# Altium project Calculator.PrjPcb
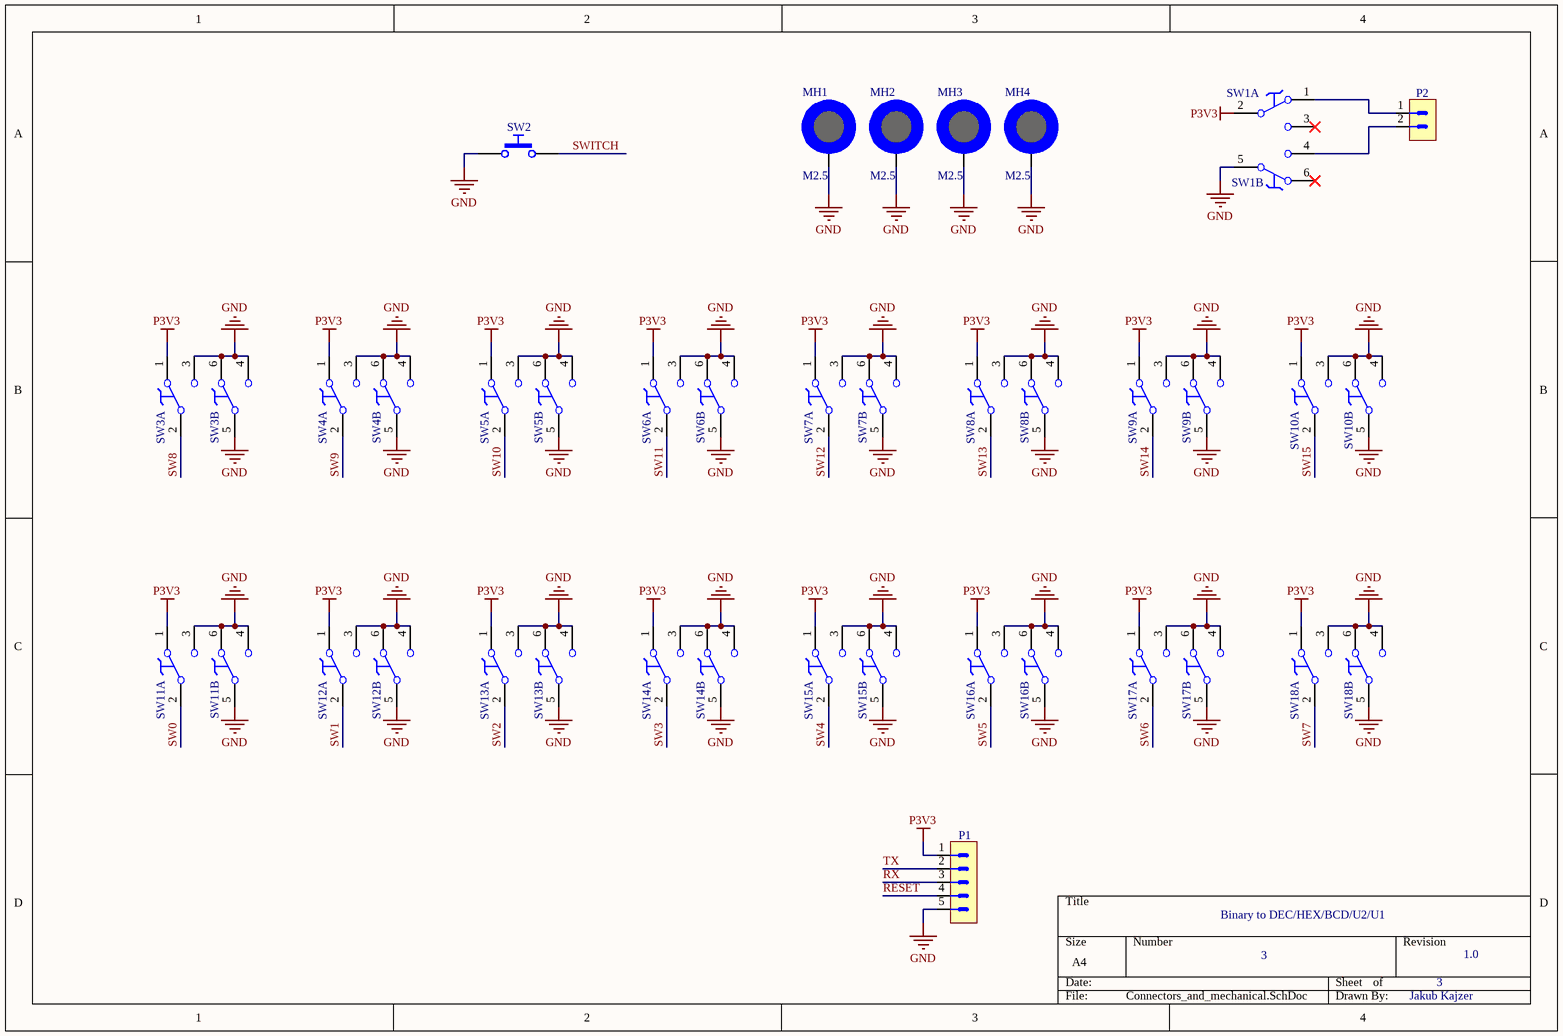
[diagram p0: Connectors_and_mechanical.SchDoc]
4 sheets, 67 parts. Net scope: global (net labels, ports and power ports of the same name join across sheets).
Board file: Calculator.PcbDoc
Sheets:
  Connectors_and_mechanical.SchDoc
  LEDs.SchDoc
  uC.SchDoc
  DCDC_Converter.SchDoc

## Sheet Connectors_and_mechanical.SchDoc: Binary to DEC/HEX/BCD/U2/U1
size A4; Author: Jakub Kajzer; DrawnBy: Jakub Kajzer; DocumentNumber: 3; Revision: 1.0; SheetNumber: 3; SheetTotal: 3

### Parts
MH1  M2.5  [MH-M2.5_COPPER]  (no BOM)
MH2  M2.5  [MH-M2.5_COPPER]  (no BOM)
MH3  M2.5  [MH-M2.5_COPPER]  (no BOM)
MH4  M2.5  [MH-M2.5_COPPER]  (no BOM)
P1  SSW-105-02-G-S  [SAMTEC_SSW-105-02-G-S]  (value not drawn)
P2  MTLW-102-07-G-S-250  [SAMTEC_MTLW-102-07-G-S-250]  (value not drawn)
SW1  SS008B  [SS008B-02P-22]  (value not drawn)  (parts A,B of 2)
SW2  PTS636  [PTS636_SMT_G]  (value not drawn)
SW3  SS008B  [SS008B-02P-22]  (value not drawn)  (parts A,B of 2)
SW4  SS008B  [SS008B-02P-22]  (value not drawn)  (parts A,B of 2)
SW5  SS008B  [SS008B-02P-22]  (value not drawn)  (parts A,B of 2)
SW6  SS008B  [SS008B-02P-22]  (value not drawn)  (parts A,B of 2)
SW7  SS008B  [SS008B-02P-22]  (value not drawn)  (parts A,B of 2)
SW8  SS008B  [SS008B-02P-22]  (value not drawn)  (parts A,B of 2)
SW9  SS008B  [SS008B-02P-22]  (value not drawn)  (parts A,B of 2)
SW10  SS008B  [SS008B-02P-22]  (value not drawn)  (parts A,B of 2)
SW11  SS008B  [SS008B-02P-22]  (value not drawn)  (parts A,B of 2)
SW12  SS008B  [SS008B-02P-22]  (value not drawn)  (parts A,B of 2)
SW13  SS008B  [SS008B-02P-22]  (value not drawn)  (parts A,B of 2)
SW14  SS008B  [SS008B-02P-22]  (value not drawn)  (parts A,B of 2)
SW15  SS008B  [SS008B-02P-22]  (value not drawn)  (parts A,B of 2)
SW16  SS008B  [SS008B-02P-22]  (value not drawn)  (parts A,B of 2)
SW17  SS008B  [SS008B-02P-22]  (value not drawn)  (parts A,B of 2)
SW18  SS008B  [SS008B-02P-22]  (value not drawn)  (parts A,B of 2)

### Nets
GND: MH1.MH MH2.MH MH3.MH MH4.MH P1.5 SW1.5 SW2.1 SW3.3 SW3.4 SW3.5 SW3.6 SW4.3 SW4.4 SW4.5 SW4.6 SW5.3 SW5.4 SW5.5 SW5.6 SW6.3 SW6.4 SW6.5 SW6.6 SW7.3 SW7.4 SW7.5 SW7.6 SW8.3 SW8.4 SW8.5 SW8.6 SW9.3 SW9.4 SW9.5 SW9.6 SW10.3 SW10.4 SW10.5 SW10.6 SW11.3 SW11.4 SW11.5 SW11.6 SW12.3 SW12.4 SW12.5 SW12.6 SW13.3 SW13.4 SW13.5 SW13.6 SW14.3 SW14.4 SW14.5 SW14.6 SW15.3 SW15.4 SW15.5 SW15.6 SW16.3 SW16.4 SW16.5 SW16.6 SW17.3 SW17.4 SW17.5 SW17.6 SW18.3 SW18.4 SW18.5 SW18.6
P3V3: P1.1 SW1.2 SW3.1 SW4.1 SW5.1 SW6.1 SW7.1 SW8.1 SW9.1 SW10.1 SW11.1 SW12.1 SW13.1 SW14.1 SW15.1 SW16.1 SW17.1 SW18.1
RESET: P1.4
RX: P1.3
SW0: SW11.2
SW1: SW12.2
SW2: SW13.2
SW3: SW14.2
SW4: SW15.2
SW5: SW16.2
SW6: SW17.2
SW7: SW18.2
SW8: SW3.2
SW9: SW4.2
SW10: SW5.2
SW11: SW6.2
SW12: SW7.2
SW13: SW8.2
SW14: SW9.2
SW15: SW10.2
SWITCH: SW2.2
TX: P1.2
NetP2_1: P2.1 SW1.1
NetP2_2: P2.2 SW1.4

Not connected (* = marked no-connect by the designer): SW1 3* 6*

### Library data of the parts
MH1-MH4 = MH-M2.5_C: Mounting hole, M2.5, exposed pad; DesignItemId: MH-M2.5_C; Author: KB; Family: M2.5; Part Description: Mounting hole, M2.5, exposed pad; Create Date: 19.05.2011; LatestRevisionDate: 19.05.2011
P1 = HDR_THT_5X1V_F_2P54MM: General Purpose Header: THT, 2.54mm, Female, Straight, Long Lead; Manufacturer: GENERIC; Manufacturer 1 Example: Samtec; Manufacturer 1 Component Height: 11.55mm; Current Max: 3A; PressFit: No; Alt_Comment: SSW; DesignItemId: HDR_THT_5X1V_F_2P54MM; Author: UN; Family: SSW; Component Kind: Standard; Footprint: HDR_5X1V_F_2P54MM; HelpURL: https://pl.mouser.com/datasheet/2/527/ssw_th-1507658.pdf; Manufacturer Part Number: HDR_THT_5X1V_F_2P54MM; Manufacturer 1 Part Number: SSW-105-02-G-S; Mounted: Yes; Part Description: General Purpose Header: THT, 2.54mm, Female, Straight, Long Lead; Pin Count: 5; Sense: No; SMD: No; Socket: No; Status: Recommended; Supplier 1: TME; Supplier 2: Mouser; Create Date: 19.08.2014; LatestRevisionDate: 19.08.2014; Supplier Part Number 1: ZL262-5SG
P2 = HDR_THT_2X1V_M_2P54MM: General Purpose Header: THT, 2.54mm, Male, Straight; Manufacturer: GENERIC; Manufacturer 1 Example: Samtec; Manufacturer 1 Component Height: 10.92mm; Current Max: 5.2A; PressFit: No; Alt_Comment: MLTW; DesignItemId: HDR_THT_2X1V_M_2P54MM; Author: PC; Family: MLTW; Component Kind: Standard; Footprint: HDR_2X1V_M_2P54MM; HelpURL: https://pl.mouser.com/datasheet/2/527/mtlw_th-1370324.pdf; Manufacturer Part Number: HDR_THT_2X1V_M_2P54MM; Manufacturer 1 Part Number: MTLW-102-07-G-S-250; Mounted: Yes; Part Description: General Purpose Header: THT, 2.54mm, Male, Straight; Pin Count: 2; Sense: No; SMD: No; Socket: No; Status: Recommended; Supplier 1: Mouser; Supplier 2: Digi-Key; Supplier 3: Sager Electronics / Sager Electronics; Create Date: 19.08.2013; LatestRevisionDate: 19.08.2013; Supplier Part Number 1: 200-MTLW10207GS250
SW1 SW3-SW18 = SS008B-02P-22: Switch  2 position; DPDT; 0,3A/30VDC; ON-ON; 50mŁ[; Manufacturer: CANAL ELECTRONIC; Manufacturer 1 Component Height: 4.7mm; PressFit: No; DesignItemId: SS008B-02P-22; Author: JK; Family: SS008B; Component Kind: Standard; HelpURL: https://www.tme.eu/Document/b70a8664e2e58da8ce3209f25de299f1/ss008b02p22.pdf; Manufacturer Part Number: SS008B-02P-22; Manufacturer 1 Example: CANAL ELECTRONIC; Manufacturer 1 Part Number: SS008B-02P-22; Mounted: Yes; Part Description: Switch  2 position; DPDT; 0,3A/30VDC; ON-ON; 50mŁ[; Pin Count: 6; Sense: No; SMD: No; Socket: No; Status: Recommended; Supplier 1: TME; Create Date: 04.12.2019; LatestRevisionDate: 04.12.2019; Supplier Part Number 1: SS008B02P22
SW2 = SMD_TACT_6P0X3P5MM: Tactile Switches Tact 50mA 12VDC, 6.0x3.5, 4.3mm H, 180gf, G leads, No ground pin, Black Actuator; Manufacturer: C&K; Manufacturer Part Number: PTS636 SM43 SMTR LFS; Manufacturer 1 Example: S&K; PressFit: No; DesignItemId: SMD_TACT_6P0X3P5MM; Author: KB; Family: PTS636; Component Kind: Standard; HelpURL: https://pl.mouser.com/datasheet/2/60/pts636-1550567.pdf; Manufacturer 1 Part Number: PTS636 SM43 SMTR LFS; Manufacturer 1 Component Height: 4.3mm; Mounted: Yes; Part Description: Tactile Switches Tact 50mA 12VDC, 6.0x3.5, 4.3mm H, 180gf, G leads, No ground pin, Black Actuator; Pin Count: 2; Sense: No; SMD: Yes; Socket: No; Status: Recommended; Supplier 1: Mouser; Supplier 2: Digi-Key; Create Date: 30.07.2019; LatestRevisionDate: 30.07.2019; Supplier Part Number 1: 611-PTS636SM43SMTRLF

## Sheet LEDs.SchDoc: Binary to DEC/HEX/BCD/U2/U1
size A4; DrawnBy: Jakub Kajzer; Revision: 1.0; SheetNumber: 2; SheetTotal: 3
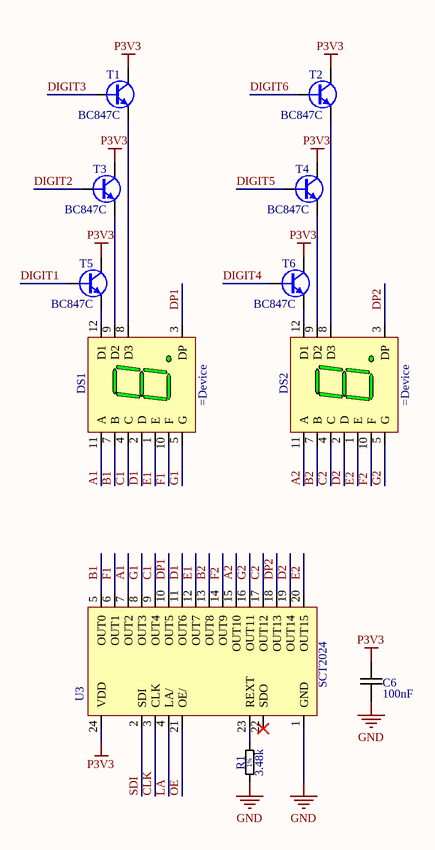
[diagram p1: LEDs.SchDoc]

### Parts
C6  100nF  [CAPC0402X60N]
DS1  (no value)  [7seg_3digits]
DS2  (no value)  [7seg_3digits]
R1  3.48k  [RESC0402X40N]
T1  BC847C  [SOT23-3]
T2  BC847C  [SOT23-3]
T3  BC847C  [SOT23-3]
T4  BC847C  [SOT23-3]
T5  BC847C  [SOT23-3]
T6  BC847C  [SOT23-3]
U3  SCT2024  [SOP-24_N]

### Nets
GND: C6.1 R1.1 U3.1(GND)
P3V3: C6.2 T1.3(C) T2.3(C) T3.3(C) T4.3(C) T5.3(C) T6.3(C) U3.24(VDD)
A1: DS1.11(A) U3.7(OUT2)
A2: DS2.11(A) U3.15(OUT10)
B1: DS1.7(B) U3.5(OUT0)
B2: DS2.7(B) U3.13(OUT8)
C1: DS1.4(C) U3.9(OUT4)
C2: DS2.4(C) U3.17(OUT12)
CLK: U3.3(CLK)
D1: DS1.2(D) U3.11(OUT6)
D2: DS2.2(D) U3.19(OUT14)
DIGIT1: T5.1(B)
DIGIT2: T3.1(B)
DIGIT3: T1.1(B)
DIGIT4: T6.1(B)
DIGIT5: T4.1(B)
DIGIT6: T2.1(B)
DP1: DS1.3(DP) U3.10(OUT5)
DP2: DS2.3(DP) U3.18(OUT13)
E1: DS1.1(E) U3.12(OUT7)
E2: DS2.1(E) U3.20(OUT15)
F1: DS1.10(F) U3.6(OUT1)
F2: DS2.10(F) U3.14(OUT9)
G1: DS1.5(G) U3.8(OUT3)
G2: DS2.5(G) U3.16(OUT11)
LA: U3.4(LA/)
OE: U3.21(OE/)
SDI: U3.2(SDI)
NetDS1_8: DS1.8(D3) T1.2(E)
NetDS1_9: DS1.9(D2) T3.2(E)
NetDS1_12: DS1.12(D1) T5.2(E)
NetDS2_8: DS2.8(D3) T2.2(E)
NetDS2_9: DS2.9(D2) T4.2(E)
NetDS2_12: DS2.12(D1) T6.2(E)
NetR1_2: R1.2 U3.23(REXT)

Not connected (* = marked no-connect by the designer): U3 22(SDO)*

### Library data of the parts
C6 = CC0402_100NF_16V_10%_X7R: Non-polarised capacitor; Manufacturer: GENERIC; Manufacturer 1 Example: Samsung; Manufacturer 1 Part Number: CL05B104KO5NNNC; Manufacturer 1 Component Height: 0.5mm; PressFit: No; Dielectric: X7R; Tolerance: 10%; Voltage: 16V; DesignItemId: CC0402_100NF_16V_10%_X7R; Author: KB; Case: 0402 (1005 metric); Component Kind: Standard; HelpURL: http://www.farnell.com/datasheets/1870456.pdf?_ga=2.66904750.1666480506.1564307475-778048469.1556931874&_gac=1.242951606.1563147047.EAIaIQobChMIrfuAvMi14wIVB-J3Ch1XegfpEAYYASABEgIMVfD_BwE; Manufacturer Part Number: CC0402_100NF_16V_10%_X7R; Mounted: Yes; Part Description: Non-polarised capacitor; Pin Count: 2; Sense: No; SMD: Yes; Socket: No; Status: Recommended; Value: 100nF; Supplier 1: TME; Supplier 2: Farnell; Supplier 3: Mouser; Create Date: 29.07.2019; LatestRevisionDate: 29.07.2019; Supplier Part Number 1: CL05B104KO5NNNC; Supplier Part Number 2: 1758896; Supplier Part Number 3: 710-885012205037
DS1 DS2 = 7-Segment Green Display CA 3-Digits: 7-seg LED Display; 9.14mm; 0.36ˇ¨; 3 Digits; Green; Manufacturer: Generic; Manufacturer 1 Example: WENRUN; Manufacturer 1 Part Number: LTD036BAG-101A-02; Manufacturer 1 Component Height: 7.2mm; PressFit: No; DesignItemId: 7-Segment Green Display CA 3-Digits; Author: JK; Color: Green; Component Kind: Standard; HelpURL: https://www.tme.eu/Document/a6075032405c075918ac13897b6973d4/LTD036BAG-101A.pdf; Mounted: YES; Part Description: 7-seg LED Display; 9.14mm; 0.36ˇ¨; 3 Digits; Green; Pin Count: 12; Sense: No; SMD: No; Socket: No; Supplier 1: TME; Create Date: 04.12.2019; LatestRevisionDate: 04.12.2019; Supplier Part Number 1: LTD036BAG-101A
R1 = R0402_3K48_0.0625W_100PPM: General Purpose Thick Film Chip Resistor; Manufacturer: GENERIC; Manufacturer Part Number: R0402_3K48_0.0625W 0.1W 0.125W 0.25W 0.5W 1W 0.75W 1W_100PPM; Manufacturer 1 Example: Vishay; Manufacturer 1 Part Number: CRCW04023K48FKEDC; Manufacturer 1 Component Height: 0.4mm; Power: 62.5mW; Current Max: 0; PressFit: No; TC: ±100 ppm/°C; Tolerance: 1%; Voltage: 50V; DesignItemId: R0402_3K48_0.0625W_100PPM; Author: KB; Case: 0402 (1005 metric); Component Kind: Standard; Component Type: Standard; HelpURL: https://www.vishay.com/docs/20035/dcrcwe3.pdf; Mounted: Yes; Part Description: General Purpose Thick Film Chip Resistor; Pin Count: 2; Sense: No; SMD: Yes; Socket: No; Status: Recommended; Value: 3.48k; Supplier 1: Farnell; Supplier 2: TME; Supplier 3: Mouser; Create Date: 03.07.2019; LatestRevisionDate: 03.07.2019; Alt_Comment: 3.48k
T1-T6 = BC847C: NPN Bipolar Transistor, 45V, 100mA, 250mW, SOT23; Manufacturer 1 Example: Nexperia; Manufacturer 1 Part Number: BC847C.215; Manufacturer 1 Component Height: 1.05mm; PressFit: No; DesignItemId: BC847C; Author: KB; Device: BC847C; Component Kind: Standard; HelpURL: https://assets.nexperia.com/documents/data-sheet/BC847_SER.pdf; Mounted: Yes; Part Description: NPN Bipolar Transistor, 45V, 100mA, 250mW, SOT23; Pin Count: 3; Sense: No; SMD: Yes; Socket: No; Supplier 1: TME; Supplier 2: Farnell; Supplier 3: Mouser; Create Date: 19.04.2009; LatestRevisionDate: 19.04.2009; Supplier Part Number 1: BC847C.215; Supplier Part Number 2: 1081235; Supplier Part Number 3: 771-BC847C-T/R
U3 = SCT2024: Driver, kontroler LED, 5ˇĹ0mA, Kanały: 16, 3ˇĹ,5V, SOP24; Manufacturer: Generic; Manufacturer 1 Example: STARCHIPS TECHNOLOGY; Manufacturer 1 Part Number: SCT2024CSOG; Manufacturer 1 Component Height: 2.65mm; PressFit: No; DesignItemId: SCT2024; Author: UN; Component Kind: Standard; HelpURL: https://www.tme.eu/Document/8876e3da3e0cc25d8b4c7cdeea8b8a88/SCT2024.pdf; Mounted: Yes; Part Description: Driver, kontroler LED, 5ˇĹ0mA, Kanały: 16, 3ˇĹ,5V, SOP24; Pin Count: 24; Sense: No; SMD: Yes; Socket: No; Supplier 1: TME; Create Date: 14.08.2019; LatestRevisionDate: 14.08.2019; Supplier Part Number 1: SCT2024CSOG

## Sheet uC.SchDoc: Binary to DEC/HEX/BCD/U2/U1
size A4; DrawnBy: Jakub Kajzer; Revision: 1.0; SheetNumber: 1; SheetTotal: 3
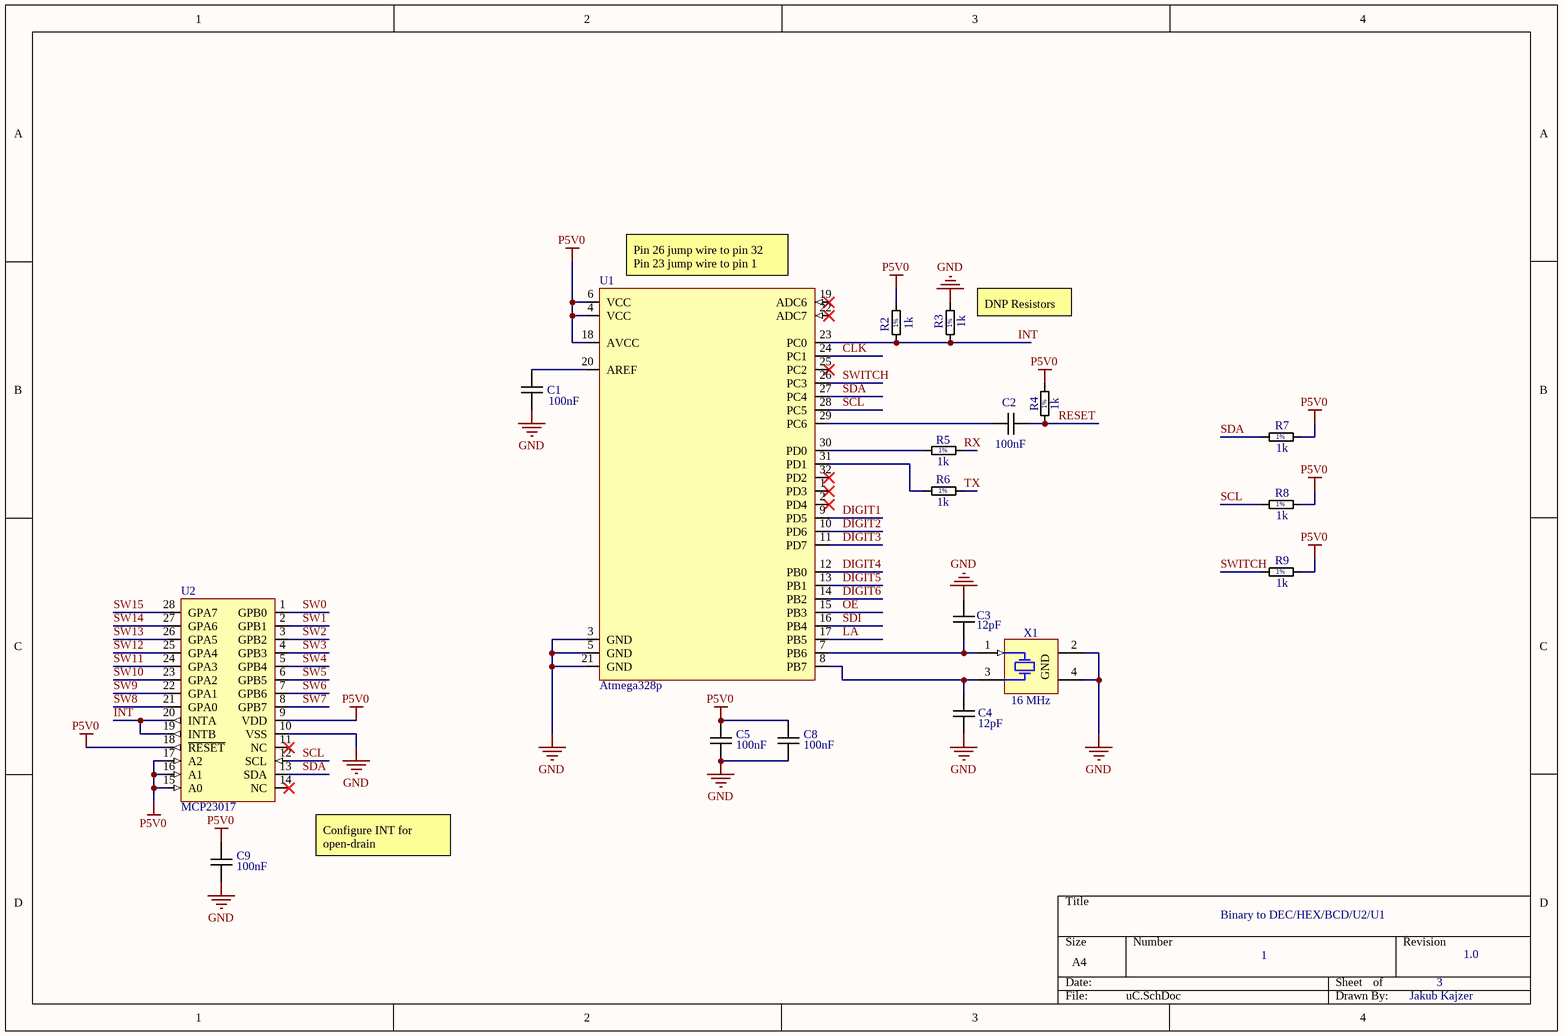
[diagram p2: uC.SchDoc]

### Parts
C1  100nF  [CAPC0402X60N]
C2  100nF  [CAPC0402X60N]
C3  12pF  [CAPC0402X60N]
C4  12pF  [CAPC0402X60N]
C5  100nF  [CAPC0402X60N]
C8  100nF  [CAPC0402X60N]
C9  100nF  [CAPC0402X60N]
R2  1k  [RESC0402X40N]
R3  1k  [RESC0402X40N]
R4  1k  [RESC0402X40N]
R5  1k  [RESC0402X40N]
R6  1k  [RESC0402X40N]
R7  1k  [RESC0402X40N]
R8  1k  [RESC0402X40N]
R9  1k  [RESC0402X40N]
U1  Atmega328p  [STM-LQFP32_N]
U2  MCP23017  [SSOP28]
X1  16 MHz  [LFXTAL069392CUTT]

### Nets
GND: C1.1 C3.2 C4.1 C5.1 C8.1 C9.1 R3.2 U1.3(GND) U1.5(GND) U1.21(GND) U2.10(VSS) X1.2(GND) X1.4(GND)
P5V0: C5.2 C8.2 C9.2 R2.2 R4.2 R7.2 R8.2 R9.2 U1.4(VCC) U1.6(VCC) U1.18(AVCC) U2.9(VDD) U2.15(A0) U2.16(A1) U2.17(A2) U2.18(~{RESET})
CLK: U1.24(PC1)
DIGIT1: U1.9(PD5)
DIGIT2: U1.10(PD6)
DIGIT3: U1.11(PD7)
DIGIT4: U1.12(PB0)
DIGIT5: U1.13(PB1)
DIGIT6: U1.14(PB2)
INT: R2.1 R3.1 U1.23(PC0) U2.19(INTB) U2.20(INTA)
LA: U1.17(PB5)
OE: U1.15(PB3)
RESET: C2.2 R4.1
RX: R5.2
SCL: R8.1 U1.28(PC5) U2.12(SCL)
SDA: R7.1 U1.27(PC4) U2.13(SDA)
SDI: U1.16(PB4)
SW0: U2.1(GPB0)
SW1: U2.2(GPB1)
SW2: U2.3(GPB2)
SW3: U2.4(GPB3)
SW4: U2.5(GPB4)
SW5: U2.6(GPB5)
SW6: U2.7(GPB6)
SW7: U2.8(GPB7)
SW8: U2.21(GPA0)
SW9: U2.22(GPA1)
SW10: U2.23(GPA2)
SW11: U2.24(GPA3)
SW12: U2.25(GPA4)
SW13: U2.26(GPA5)
SW14: U2.27(GPA6)
SW15: U2.28(GPA7)
SWITCH: R9.1 U1.26(PC3)
TX: R6.2
NetC1_2: C1.2 U1.20(AREF)
NetC2_1: C2.1 U1.29(PC6)
NetC3_1: C3.1 U1.7(PB6) X1.1(X)
NetC4_2: C4.2 U1.8(PB7) X1.3(X)
NetR5_1: R5.1 U1.30(PD0)
NetR6_1: R6.1 U1.31(PD1)

Not connected (* = marked no-connect by the designer): U1 1(PD3)* 2(PD4)* 19(ADC6)* 22(ADC7)* 25(PC2)* 32(PD2)*; U2 11(NC)* 14(NC)*

### Notes on the sheet
- (near U1) Pin 26 jump wire to pin 32
  Pin 23 jump wire to pin 1
- (near R3) DNP Resistors
- (near U2) Configure INT for open-drain

### Library data of the parts
C1 C2 C5 C8 C9 = CC0402_100NF_16V_10%_X7R: as C6 on sheet LEDs; DesignItemId: CC0402_100NF_16V_10%_X7R; Author: KB; Case: 0402 (1005 metric); Component Kind: Standard; HelpURL: http://www.farnell.com/datasheets/1870456.pdf?_ga=2.66904750.1666480506.1564307475-778048469.1556931874&_gac=1.242951606.1563147047.EAIaIQobChMIrfuAvMi14wIVB-J3Ch1XegfpEAYYASABEgIMVfD_BwE; Manufacturer Part Number: CC0402_100NF_16V_10%_X7R; Mounted: Yes; Part Description: Non-polarised capacitor; Pin Count: 2; Sense: No; SMD: Yes; Socket: No; Status: Recommended; Value: 100nF; Supplier 1: TME; Supplier 2: Farnell; Supplier 3: Mouser; Create Date: 29.07.2019; LatestRevisionDate: 29.07.2019; Supplier Part Number 1: CL05B104KO5NNNC; Supplier Part Number 2: 1758896; Supplier Part Number 3: 710-885012205037
C3 C4 = CC0402_12PF_50V_5%_C0G: Non-polarised capacitor; Manufacturer: GENERIC; Manufacturer 1 Example: Murata; Manufacturer 1 Part Number: GRM1555C1H120JA01D; Manufacturer 1 Component Height: 0.5mm; PressFit: No; Dielectric: C0G; Tolerance: 5%; Voltage: 50V; DesignItemId: CC0402_12PF_50V_5%_C0G; Author: KB; Case: 0402 (1005 metric); Component Kind: Standard; HelpURL: https://search.murata.co.jp/Ceramy/image/img/A01X/G101/ENG/GJM1555C1H7R5CB01-01.pdf; Manufacturer Part Number: CC0402_12PF_50V_5%_C0G; Mounted: Yes; Part Description: Non-polarised capacitor; Pin Count: 2; Sense: No; SMD: Yes; Socket: No; Status: Recommended; Value: 12pF; Supplier 1: TME; Supplier 2: Farnell; Supplier 3: Mouser; Create Date: 28.07.2019; LatestRevisionDate: 28.07.2019; Supplier Part Number 1: GRM1555C1H120JA01D; Supplier Part Number 2: 1758943; Supplier Part Number 3: 81-GCM1555C1H120JA6J
R2-R9 = R0402_1K00_0.0625W_100PPM: General Purpose Thick Film Chip Resistor; Manufacturer: GENERIC; Manufacturer Part Number: R0402_1K00_0.0625W 0.1W 0.125W 0.25W 0.5W 1W 0.75W 1W_100PPM; Manufacturer 1 Example: Vishay; Manufacturer 1 Part Number: CRCW04021K00FKEDC; Manufacturer 1 Component Height: 0.4mm; Power: 62.5mW; Current Max: 0; PressFit: No; TC: ±100 ppm/°C; Tolerance: 1%; Voltage: 50V; DesignItemId: R0402_1K00_0.0625W_100PPM; Author: KB; Case: 0402 (1005 metric); Component Kind: Standard; Component Type: Standard; HelpURL: https://www.vishay.com/docs/20035/dcrcwe3.pdf; Mounted: Yes; Part Description: General Purpose Thick Film Chip Resistor; Pin Count: 2; Sense: No; SMD: Yes; Socket: No; Status: Recommended; Value: 1k; Supplier 1: Farnell; Supplier 2: Mouser; Supplier 3: TME; Create Date: 03.07.2019; LatestRevisionDate: 03.07.2019; Supplier Part Number 3: CRCW04021K00FKED; Supplier Part Number 2: 71-CRCW0402-1.0K-E3
U1 = Atmega328p: 8-bit AVR Microcontroller with 32K Bytes In-SystemProgrammable Flash; Manufacturer 1 Example: Atmel; Manufacturer 1 Part Number: ATMEGA328PB-AU; Manufacturer 1 Component Height: 1.2mm; PressFit: No; DesignItemId: Atmega328p; Author: JK; Device: Atmega328p; Component Kind: Standard; Footprint: LQFP-32; HelpURL: http://ww1.microchip.com/downloads/en/DeviceDoc/Atmel-7810-Automotive-Microcontrollers-ATmega328P_Datasheet.pdf; Mounted: Yes; Part Description: 8-bit AVR Microcontroller with 32K Bytes In-SystemProgrammable Flash; Pin Count: 32; Sense: No; SMD: Yes; Socket: No; Supplier 1: TME; Create Date: 21.12.2019; LatestRevisionDate: 21.12.2019; Supplier Part Number 1: ATMEGA328PB-AU
U2 = MCP23017-E/SS: 16-Bit I/O Expander with Serial Interface; Manufacturer 1 Example: Microchip; Manufacturer 1 Component Height: 1.75mm; PressFit: No; DesignItemId: MCP23017-E/SS; Author: JK; Device: MCP23017; Component Kind: Standard; HelpURL: https://www.tme.eu/Document/4a5fbc9d683fd19f7c43480a0c75c888/mcp23017.pdf; Manufacturer 1 Part Number: MCP23017-E/SS; Mounted: Yes; Part Description: 16-Bit I/O Expander with Serial Interface; Pin Count: 28; Sense: No; SMD: Yes; Socket: No; Supplier 1: Mouser; Supplier 2: Farnell; Supplier 3: TME; Create Date: 06.09.2019; LatestRevisionDate: 06.09.2019; Supplier Part Number 3: MCP23017-E/SS; Supplier Part Number 2: 1467674; Supplier Part Number 1: 579-MCP23017-E/SS
X1 = LFXTAL069392CUTT: ˇĹ0ppm 10pF -40°C to +85°C  4 Pins, 2.5x2X0.6mm; Manufacturer 1 Example: IQD FREQUENCY PRODUCTS; Manufacturer 1 Component Height: 0.6; PressFit: No; DesignItemId: LFXTAL069392CUTT; Author: PC; Value: 16 MHz; Component Kind: Standard; HelpURL: https://www.tme.eu/Document/39c21ac8c088601505d794405896ec92/LFXTAL069392Cutt.pdf; Manufacturer 1 Part Number: LFXTAL069392CUTT; Mounted: Yes; Part Description: ˇĹ0ppm 10pF -40°C to +85°C  4 Pins, 2.5x2X0.6mm; Pin Count: 4; Sense: No; SMD: Yes; Socket: No; Supplier 1: TME; Supplier 2: Mouser; Create Date: 19.08.2009; LatestRevisionDate: 19.08.2009; Supplier Part Number 2: 449-LFXTAL069392CUTT; Supplier Part Number 1: 16.00M-CFPX-218

## Sheet DCDC_Converter.SchDoc
size A4
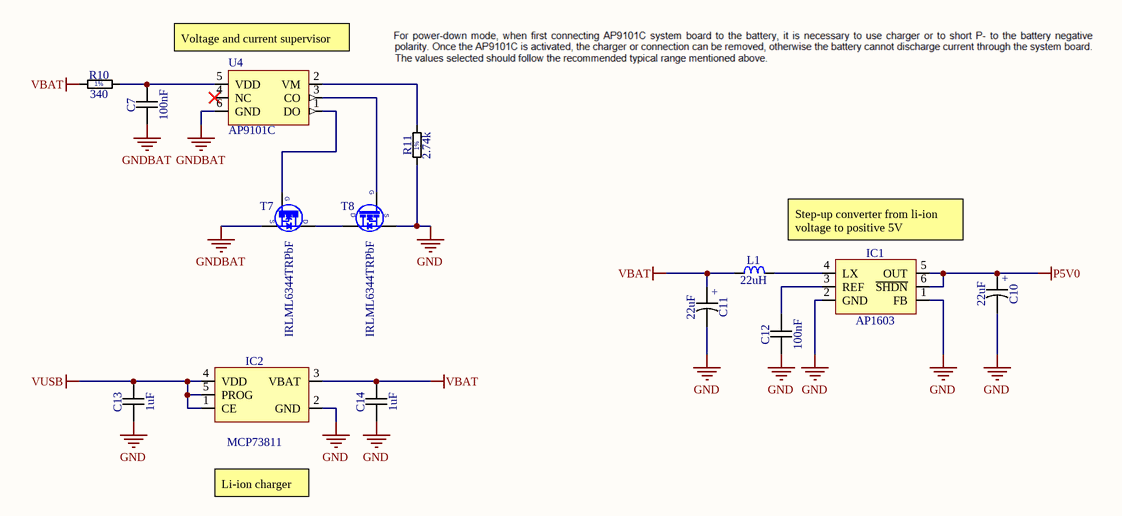
[diagram p3: DCDC_Converter.SchDoc]

### Parts
C7  100nF  [CAPC0402X60N]
C10  22uF  [CAPC2917X310N]
C11  22uF  [CAPC2917X310N]
C12  100nF  [CAPC0603X90N]
C13  1uF  [CAPC0603X90N]
C14  1uF  [CAPC0603X90N]
IC1  AP1603  [SOT26]
IC2  MCP73811  [SOT23-5]
L1  22uH  [INDC1210X150N]
R10  340  [RESC0603X60N]
R11  2.74k  [RESC0603X60N]
T7  IRLML6344TRPbF  [SOT23-3]
T8  IRLML6344TRPbF  [SOT23-3]
U4  AP9101C  [SOT26]

### Nets
GND: C10.2 C11.2 C12.1 C13.1 C14.1 IC1.1(FB) IC1.2(GND) IC2.2(GND) R11.1 T8.2(S)
GNDBAT: C7.1 T7.2(S) U4.6(GND)
P5V0: C10.1 IC1.5(OUT) IC1.6(~{SHDN})
VBAT: C11.1 C14.2 IC2.3(VBAT) L1.1 R10.1
VUSB: C13.2 IC2.1(CE) IC2.4(VDD) IC2.5(PROG)
NetC7_2: C7.2 R10.2 U4.5(VDD)
NetC12_2: C12.2 IC1.3(REF)
NetIC1_4: IC1.4(LX) L1.2
NetR11_2: R11.2 U4.2(VM)
NetT7_1: T7.1(G) U4.1(DO)
NetT7_3: T7.3(D) T8.3(D)
NetT8_1: T8.1(G) U4.3(CO)

Not connected (* = marked no-connect by the designer): U4 4(NC)*

### Notes on the sheet
- Voltage and current supervisor
- Step-up converter from li-ion voltage to positive 5V
- Li-ion charger
- (in symbol CC2917_47UF_25V_20%_TANTALUM) +

### Library data of the parts
C7 = CC0402_100NF_16V_10%_X7R: as C6 on sheet LEDs; DesignItemId: CC0402_100NF_16V_10%_X7R; Author: KB; Case: 0402 (1005 metric); Component Kind: Standard; HelpURL: http://www.farnell.com/datasheets/1870456.pdf?_ga=2.66904750.1666480506.1564307475-778048469.1556931874&_gac=1.242951606.1563147047.EAIaIQobChMIrfuAvMi14wIVB-J3Ch1XegfpEAYYASABEgIMVfD_BwE; Manufacturer Part Number: CC0402_100NF_16V_10%_X7R; Mounted: Yes; Part Description: Non-polarised capacitor; Pin Count: 2; Sense: No; SMD: Yes; Socket: No; Status: Recommended; Value: 100nF; Supplier 1: TME; Supplier 2: Farnell; Supplier 3: Mouser; Create Date: 29.07.2019; LatestRevisionDate: 29.07.2019; Supplier Part Number 1: CL05B104KO5NNNC; Supplier Part Number 2: 1758896; Supplier Part Number 3: 710-885012205037
C10 C11 = CC2917_47UF_25V_20%_TANTALUM: Polarised capacitor; Manufacturer: GENERIC; Manufacturer Part Number: CC2917_22UF_25V_20%_TANTALUM; Manufacturer 1 Example: Vishay; Manufacturer 1 Part Number: 293D476X0025D2TE3; Manufacturer 1 Component Height: 2.8mm; PressFit: No; Tolerance: 20%; Voltage: 25V; DesignItemId: CC2917_47UF_25V_20%_TANTALUM; Author: JK; Case: 2917 (7343 metric); Component Kind: Standard; Footprint: CAPC2917X430N; HelpURL: https://www.tme.eu/Document/a5d90d85079967994fb49c0e8f8ad6e9/293d.pdf; Mounted: Yes; Part Description: Polarised capacitor; Pin Count: 2; Sense: No; SMD: Yes; Socket: No; Status: Recommended; Dielectric: TANTALUM; Value: 22uF; Supplier 1: Mouser; Supplier 2: TME; Create Date: 19.12.2019; LatestRevisionDate: 19.12.2019; Supplier Part Number 1: 74-293D476X0025D2TE3; Supplier Part Number 2: 293D476X0025D2TE3
C12 = CC0603_100NF_16V_10%_X7R: Non-polarised capacitor; Manufacturer: GENERIC; Manufacturer 1 Example: Vishay; Manufacturer 1 Part Number: VJ0603Y104KXJCW1BC; Manufacturer 1 Component Height: 0.8mm; PressFit: No; Dielectric: X7R; Tolerance: 10%; Voltage: 16V; DesignItemId: CC0603_100NF_16V_10%_X7R; Author: KB; Case: 0603 (1608 metric); Component Kind: Standard; HelpURL: https://www.vishay.com/docs/28548/vjw1bcbascomseries.pdf; Manufacturer Part Number: CC0603_100NF_16V_10%_X7R; Mounted: Yes; Part Description: Non-polarised capacitor; Pin Count: 2; Sense: No; SMD: Yes; Socket: No; Status: Recommended; Value: 100nF; Supplier 1: Farnell; Supplier 2: TME; Supplier 3: Mouser; Create Date: 01.04.2019; LatestRevisionDate: 01.04.2019; Supplier Part Number 1: 2896425; Supplier Part Number 2: VJ0603Y104KXJCW1BC; Supplier Part Number 3: 710-885012206046
C13 C14 = CC0603_1UF_6V3_10%_X7R: Non-polarised capacitor; Manufacturer: GENERIC; Manufacturer 1 Example: Samsung; Manufacturer 1 Part Number: C0603C105K9RACAUTO7411; Manufacturer 1 Component Height: 0.8mm; PressFit: No; Dielectric: X7R; Tolerance: 10%; Voltage: 6.3V; DesignItemId: CC0603_1UF_6V3_10%_X7R; Author: UN; Case: 0603 (1608 metric); Component Kind: Standard; HelpURL: https://pl.mouser.com/datasheet/2/212/KEM_C1023_X7R_AUTO_SMD-1093309.pdf; Manufacturer Part Number: CC0603_1UF_6V3_10%_X7R; Mounted: Yes; Part Description: Non-polarised capacitor; Pin Count: 2; Sense: No; SMD: Yes; Socket: No; Status: Recommended; Value: 1uF; Supplier 1: Mouser; Supplier 2: TME; Supplier 3: Farnell; Create Date: 30.08.2019; LatestRevisionDate: 30.08.2019; Supplier Part Number 1: 80-C0603C105K9RAUTLR; Supplier Part Number 2: C0603C105K9RACAU74; Supplier Part Number 3: 2860299
IC1 = AP1603: STEP-UP DC-DC CONVERTER; Manufacturer 1 Example: DIODES INCORPORATED; Manufacturer 1 Part Number: AP1603WG-7; Manufacturer 1 Component Height: 1.3mm; PressFit: No; DesignItemId: AP1603; Author: JK; Device: AP1603; Component Kind: Standard; Footprint: SO26; HelpURL: https://www.tme.eu/Document/3ad0bf81fd35619d65908fe8fa84f929/AP1603x-DTE.pdf; Mounted: Yes; Part Description: STEP-UP DC-DC CONVERTER; Pin Count: 6; Sense: No; SMD: Yes; Socket: No; Supplier 1: Mouser; Supplier 2: Farnell; Supplier 3: TME; Create Date: 19.12.2019; LatestRevisionDate: 19.12.2019; Supplier Part Number 1: 621-AP1603WG-7; Supplier Part Number 2: 1825335; Supplier Part Number 3: AP1603WG-7
IC2 = MCP73811: Simple, Miniature Single-Cell, Fully Integrate d Li-Ion / Li-Polymer Charge Management Controllers; Manufacturer 1 Example: Microchip Technology; Manufacturer 1 Part Number: MCP73811T-420I/OT; Manufacturer 1 Component Height: 1.05mm; PressFit: No; DesignItemId: MCP73811; Author: JK; Device: MCP73811; Component Kind: Standard; HelpURL: https://www.tme.eu/Document/854c2d12dac3548645f8087169cd177d/MCP73811T-420IT.pdf; Mounted: Yes; Part Description: Simple, Miniature Single-Cell, Fully Integrate d Li-Ion / Li-Polymer Charge Management Controllers; Pin Count: 5; Sense: No; SMD: Yes; Socket: No; Supplier 1: TME; Create Date: 20.12.2019; LatestRevisionDate: 20.12.2019; Supplier Part Number 1: MCP73811T-420IT
L1 = IND1210_22UH_150MA: SMD Inductor; Manufacturer: GENERIC; Manufacturer Part Number: LQH32MN220K23L; Manufacturer 1 Example: Murata; Manufacturer 1 Component Height: 2mm; PressFit: No; Tolerance: 10%; DesignItemId: IND1210_22UH_150MA; Author: JK; Case: 1210 (3225 metric); Component Kind: Standard; HelpURL: https://www.murata.com/~/media/webrenewal/support/library/catalog/products/inductor/chip/o05e.ashx; Manufacturer 1 Part Number: LQH32MN220K23L; Mounted: Yes; Part Description: SMD inductor; Pin Count: 2; Sense: No; SMD: Yes; Socket: No; Status: Recommended; Value: 22uH; Supplier 1: Mouser; Supplier 2: TME; Create Date: 19.12.2019; LatestRevisionDate: 19.12.2019; Supplier Part Number 1: 81-LQH32MN220K23L; Supplier Part Number 2: LQH32MN220K23L
R10 = R0603_340R_0.1W_100PPM: General Purpose Thick Film Chip Resistor; Manufacturer: GENERIC; Manufacturer Part Number: R0603_340R_0.0625W 0.1W 0.125W 0.25W 0.5W 1W 0.75W 1W_100PPM; Manufacturer 1 Example: Vishay; Manufacturer 1 Part Number: CRCW0603340RFKEDC; Manufacturer 1 Component Height: 0.5mm; Power: 100mW; Current Max: 0; PressFit: No; TC: ±100 ppm/°C; Tolerance: 1%; Voltage: 75V; DesignItemId: R0603_340R_0.1W_100PPM; Author: KB; Case: 0603 (1608 metric); Component Kind: Standard; Component Type: Standard; HelpURL: https://www.vishay.com/docs/20035/dcrcwe3.pdf; Mounted: Yes; Part Description: General Purpose Thick Film Chip Resistor; Pin Count: 2; Sense: No; SMD: Yes; Socket: No; Status: Recommended; Value: 340; Supplier 1: Farnell; Supplier 2: TME; Supplier 3: Mouser; Create Date: 03.07.2019; LatestRevisionDate: 03.07.2019
R11 = R0603_2K74_0.1W_100PPM: General Purpose Thick Film Chip Resistor; Manufacturer: GENERIC; Manufacturer Part Number: R0603_2K74_0.0625W 0.1W 0.125W 0.25W 0.5W 1W 0.75W 1W_100PPM; Manufacturer 1 Example: Vishay; Manufacturer 1 Part Number: CRCW06032K74FKEDC; Manufacturer 1 Component Height: 0.5mm; Power: 100mW; Current Max: 0; PressFit: No; TC: ±100 ppm/°C; Tolerance: 1%; Voltage: 75V; DesignItemId: R0603_2K74_0.1W_100PPM; Author: KB; Case: 0603 (1608 metric); Component Kind: Standard; Component Type: Standard; HelpURL: https://www.vishay.com/docs/20035/dcrcwe3.pdf; Mounted: Yes; Part Description: General Purpose Thick Film Chip Resistor; Pin Count: 2; Sense: No; SMD: Yes; Socket: No; Status: Recommended; Value: 2.74k; Supplier 1: Farnell; Supplier 2: TME; Supplier 3: Mouser; Create Date: 03.07.2019; LatestRevisionDate: 03.07.2019
T7 T8 = IRLML6344TRPBF: N-MOS 5.0A 29mOhm 30V 2.5V drv capable; Manufacturer 1 Example: Infineon; Manufacturer 1 Component Height: 1.05mm; PressFit: No; DesignItemId: IRLML6344TRPBF; Author: JK; Device: IRLML6344TRPbF; Component Kind: Standard; HelpURL: https://www.tme.eu/Document/f3dfd4e8b214f54a2960ef3507968e9d/irlml6344pbf.pdf; Manufacturer 1 Part Number: IRLML6344TRPBF; Mounted: Yes; Part Description: N-MOS 5.0A 29mOhm 30V 2.5V drv capable; Pin Count: 3; Sense: No; SMD: Yes; Socket: No; Supplier 1: TME; Supplier 2: Farnell; Supplier 3: Mouser; Create Date: 30.09.2019; LatestRevisionDate: 30.09.2019; Supplier Part Number 1: IRLML6344TRPBF; Supplier Part Number 2: 1857299; Supplier Part Number 3: 942-IRLML6344TRPBF
U4 = AP9101C: SINGLE CHIP SOLUTION FOR 1-CELL Li+ BATTERY PACK; Manufacturer 1 Example: Diodes Incorporated; Manufacturer 1 Part Number: AP9101CK6-AETRG1; Manufacturer 1 Component Height: 1.3mm; PressFit: No; DesignItemId: AP9101C; Author: JK; Device: AP9101C; Component Kind: Standard; HelpURL: https://www.tme.eu/Document/2363835cc5634a92b6e94bc773e39f4b/AP9101C.pdf; Mounted: Yes; Part Description: SINGLE CHIP SOLUTION FOR 1-CELL Li+ BATTERY PACK; Pin Count: 6; Sense: No; SMD: Yes; Socket: No; Supplier 1: TME; Create Date: 20.12.2019; LatestRevisionDate: 20.12.2019; Supplier Part Number 1: AP9101CK6-AETRG1

## Nets that join several sheets
GND: Connectors_and_mechanical (71 pins), LEDs (C6.1 R1.1 U3.1), uC (13 pins), DCDC_Converter (10 pins)
P3V3: Connectors_and_mechanical (18 pins), LEDs (8 pins)
P5V0: uC (16 pins), DCDC_Converter (C10.1 IC1.5 IC1.6)
CLK: LEDs (U3.3), uC (U1.24)
DIGIT1: LEDs (T5.1), uC (U1.9)
DIGIT2: LEDs (T3.1), uC (U1.10)
DIGIT3: LEDs (T1.1), uC (U1.11)
DIGIT4: LEDs (T6.1), uC (U1.12)
DIGIT5: LEDs (T4.1), uC (U1.13)
DIGIT6: LEDs (T2.1), uC (U1.14)
LA: LEDs (U3.4), uC (U1.17)
OE: LEDs (U3.21), uC (U1.15)
RESET: Connectors_and_mechanical (P1.4), uC (C2.2 R4.1)
RX: Connectors_and_mechanical (P1.3), uC (R5.2)
SDI: LEDs (U3.2), uC (U1.16)
SW0: Connectors_and_mechanical (SW11.2), uC (U2.1)
SW1: Connectors_and_mechanical (SW12.2), uC (U2.2)
SW2: Connectors_and_mechanical (SW13.2), uC (U2.3)
SW3: Connectors_and_mechanical (SW14.2), uC (U2.4)
SW4: Connectors_and_mechanical (SW15.2), uC (U2.5)
SW5: Connectors_and_mechanical (SW16.2), uC (U2.6)
SW6: Connectors_and_mechanical (SW17.2), uC (U2.7)
SW7: Connectors_and_mechanical (SW18.2), uC (U2.8)
SW8: Connectors_and_mechanical (SW3.2), uC (U2.21)
SW9: Connectors_and_mechanical (SW4.2), uC (U2.22)
SW10: Connectors_and_mechanical (SW5.2), uC (U2.23)
SW11: Connectors_and_mechanical (SW6.2), uC (U2.24)
SW12: Connectors_and_mechanical (SW7.2), uC (U2.25)
SW13: Connectors_and_mechanical (SW8.2), uC (U2.26)
SW14: Connectors_and_mechanical (SW9.2), uC (U2.27)
SW15: Connectors_and_mechanical (SW10.2), uC (U2.28)
SWITCH: Connectors_and_mechanical (SW2.2), uC (R9.1 U1.26)
TX: Connectors_and_mechanical (P1.2), uC (R6.2)